# Altium schematic sheet DRIVER_B.SchDoc
size 420 x 297 mm; SheetNumber: 3; PageSetup: Record=PageOptions|CenterHorizontal=False|CenterVertical=False|PrintScale=0.95|XCorrection=0.00|YCorrection=0.00|PrintKind=1|BorderSize=5000000|LeftOffset=0|BottomOffset=0|Orientation=1|PaperLength=1000|PaperWidth=1000|Scale=100|PaperSource=15|PrintQuality=600|MediaType=1|DitherType=10|PaperKind=A4|PrintScaleMode=1
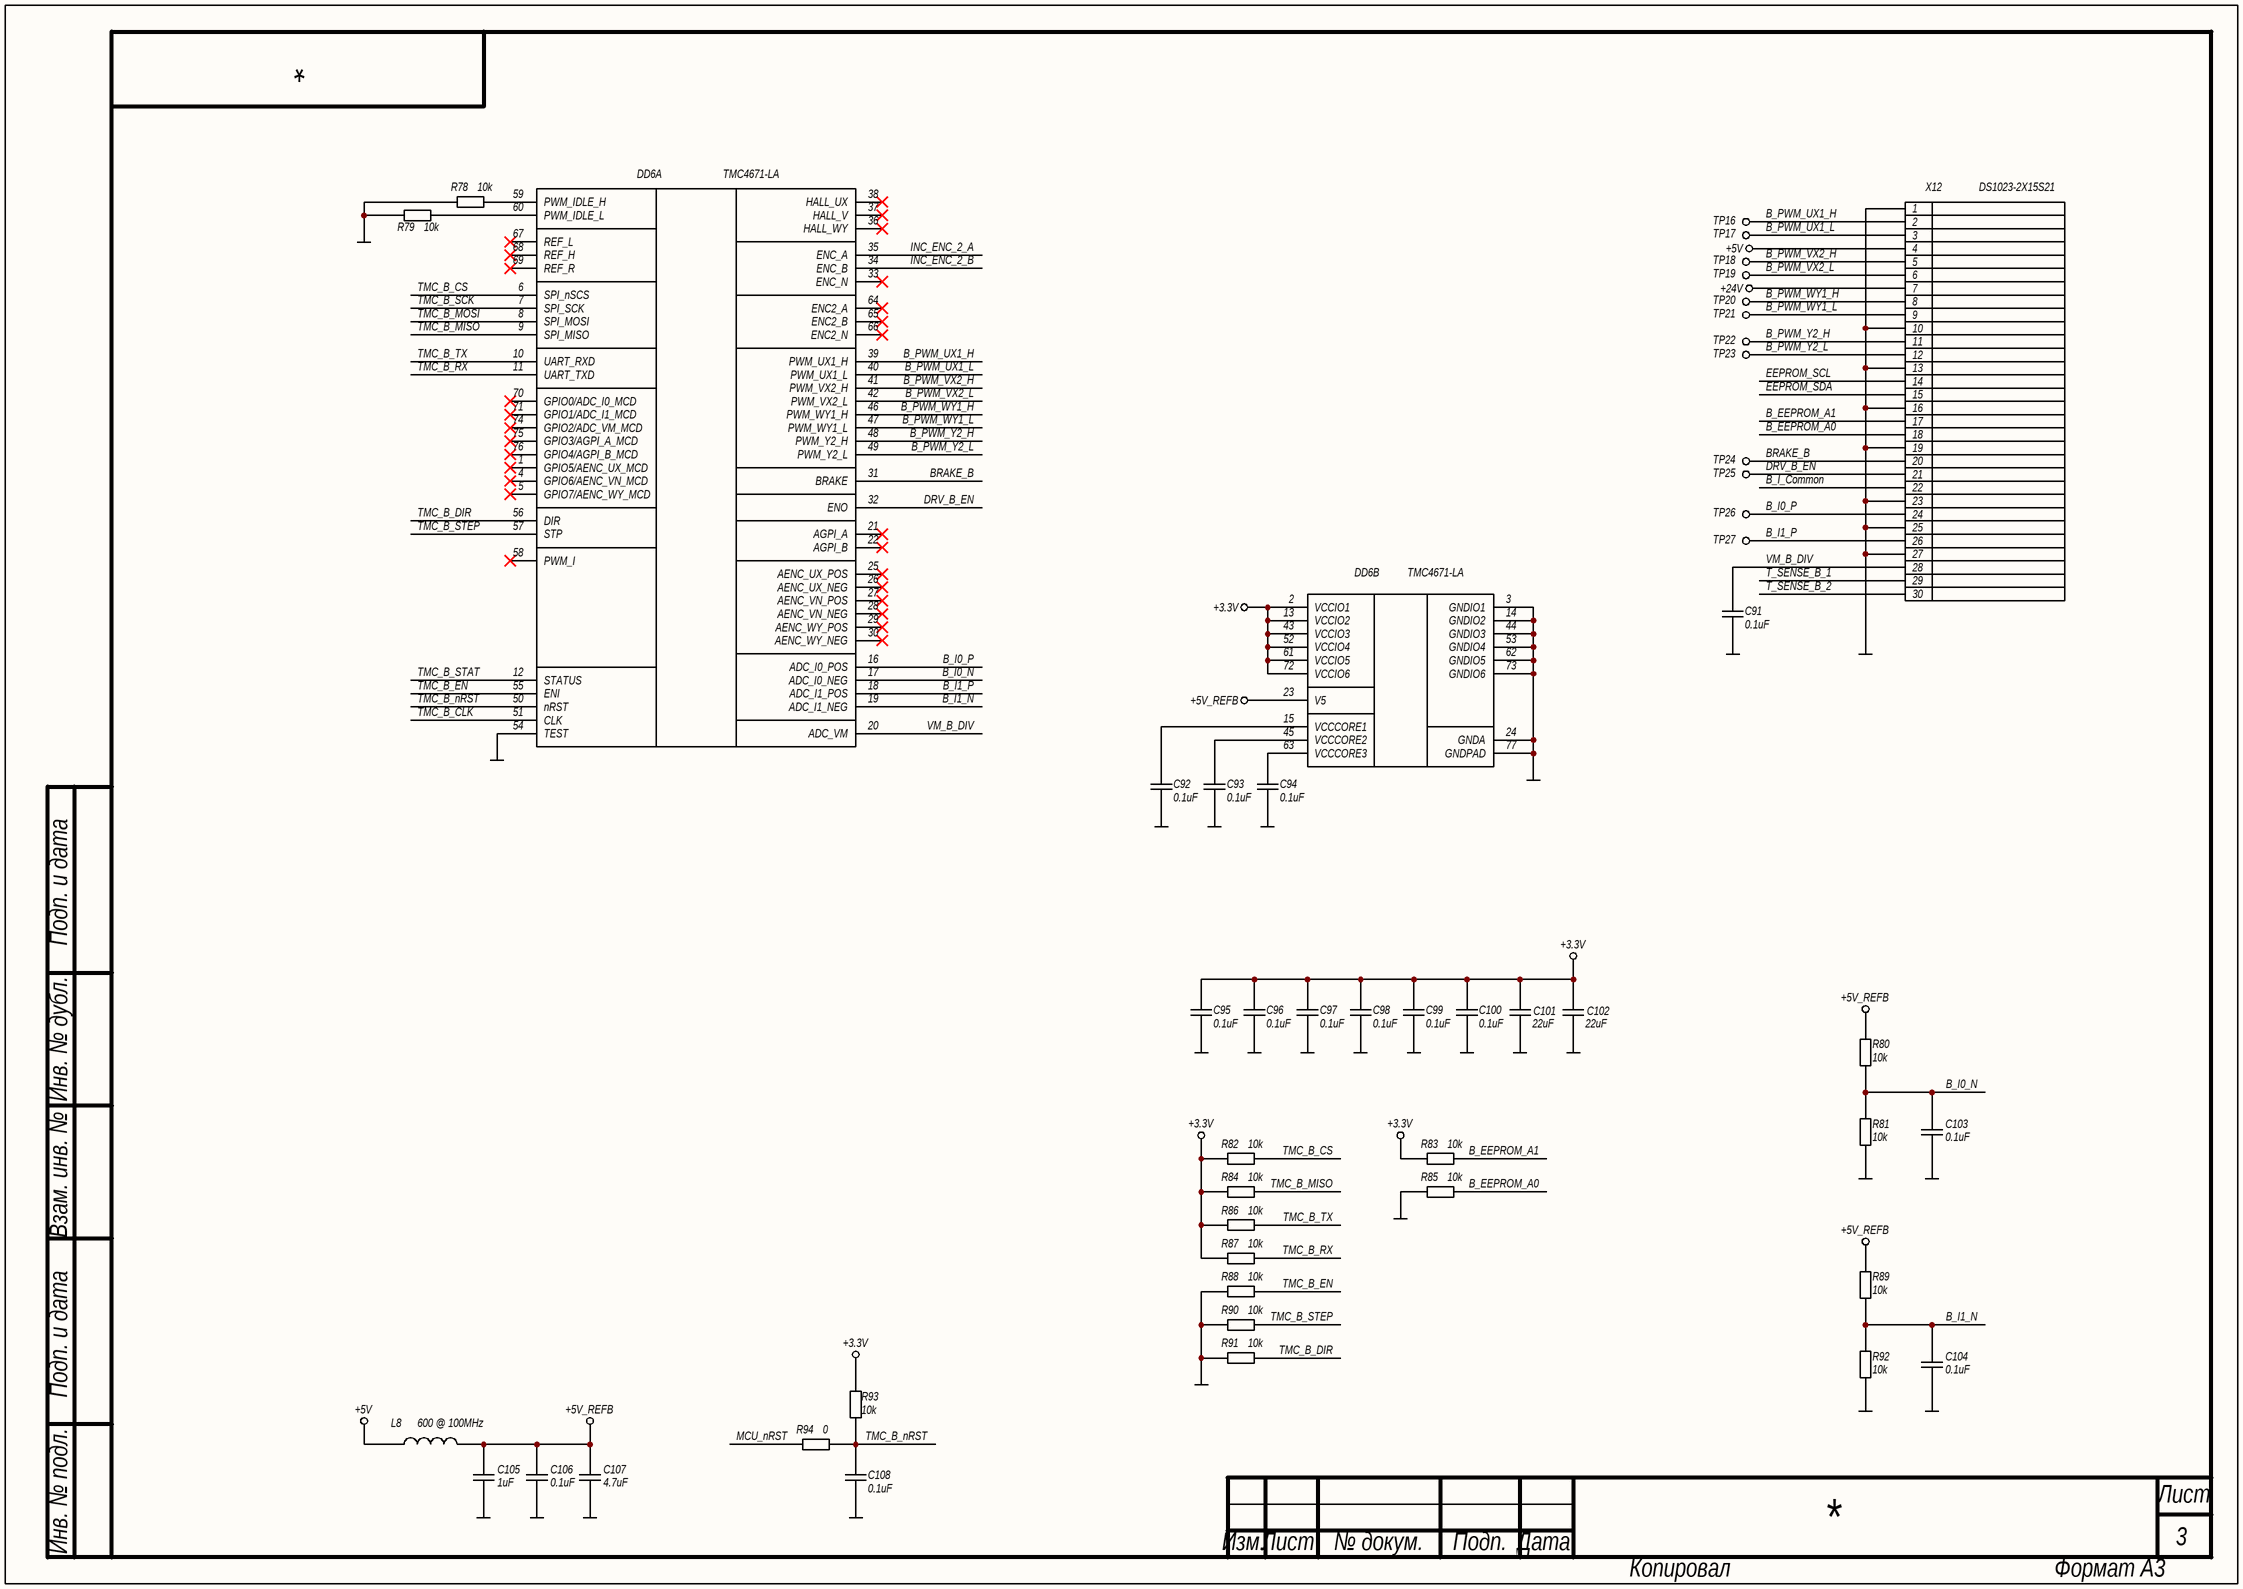
[diagram p0: DRIVER_B.SchDoc]

## Parts
C91  0.1uF  [C0603N]
C92  0.1uF  [C0603N]
C93  0.1uF  [C0603N]
C94  0.1uF  [C0603N]
C95  0.1uF  [C0603N]
C96  0.1uF  [C0603N]
C97  0.1uF  [C0603N]
C98  0.1uF  [C0603N]
C99  0.1uF  [C0603N]
C100  0.1uF  [C0603N]
C101  22uF  [C0805N]
C102  22uF  [C0805N]
C103  0.1uF  [C0603N]
C104  0.1uF  [C0603N]
C105  1uF  [C0603N]
C106  0.1uF  [C0603N]
C107  4.7uF  [C0603N]
C108  0.1uF  [C0603N]
DD6  TMC4671-LA  [QFN76-EP]  (parts A,B of 2)
L8  600 @ 100MHz  [FB0603N]
R78  10k  [R0603N]
R79  10k  [R0603N]
R80  10k  [R0603N]
R81  10k  [R0603N]
R82  10k  [R0603N]
R83  10k  [R0603N]
R84  10k  [R0603N]
R85  10k  [R0603N]
R86  10k  [R0603N]
R87  10k  [R0603N]
R88  10k  [R0603N]
R89  10k  [R0603N]
R90  10k  [R0603N]
R91  10k  [R0603N]
R92  10k  [R0603N]
R93  10k  [R0603N]
R94  0  [R0603N]
TP16  TEST_POINT  [TP_RPAD_0.8MM]  (value not drawn)  (no BOM)
TP17  TEST_POINT  [TP_RPAD_0.8MM]  (value not drawn)  (no BOM)
TP18  TEST_POINT  [TP_RPAD_0.8MM]  (value not drawn)  (no BOM)
TP19  TEST_POINT  [TP_RPAD_0.8MM]  (value not drawn)  (no BOM)
TP20  TEST_POINT  [TP_RPAD_0.8MM]  (value not drawn)  (no BOM)
TP21  TEST_POINT  [TP_RPAD_0.8MM]  (value not drawn)  (no BOM)
TP22  TEST_POINT  [TP_RPAD_0.8MM]  (value not drawn)  (no BOM)
TP23  TEST_POINT  [TP_RPAD_0.8MM]  (value not drawn)  (no BOM)
TP24  TEST_POINT  [TP_RPAD_0.8MM]  (value not drawn)  (no BOM)
TP25  TEST_POINT  [TP_RPAD_0.8MM]  (value not drawn)  (no BOM)
TP26  TEST_POINT  [TP_RPAD_0.8MM]  (value not drawn)  (no BOM)
TP27  TEST_POINT  [TP_RPAD_0.8MM]  (value not drawn)  (no BOM)
X12  DS1023-2X15S21  [2.54_2X15_SOCKET_HEADER]

## Nets
+3.3V: C95.2 C96.2 C97.2 C98.2 C99.2 C100.2 C101.2 C102.2 DD6.2(VCCIO1) DD6.13(VCCIO2) DD6.43(VCCIO3) DD6.52(VCCIO4) DD6.61(VCCIO5) DD6.72(VCCIO6) R82.2 R83.2 R84.2 R86.2 R87.2 R93.2
+5V: L8.1 X12.4
+5V_REFB: C105.2 C106.2 C107.2 DD6.23(V5) L8.2 R80.2 R89.2
+24V: X12.7
GND: C91.1 C92.1 C93.1 C94.1 C95.1 C96.1 C97.1 C98.1 C99.1 C100.1 C101.1 C102.1 C103.1 C104.1 C105.1 C106.1 C107.1 C108.1 DD6.3(GNDIO1) DD6.14(GNDIO2) DD6.24(GNDA) DD6.44(GNDIO3) DD6.53(GNDIO4) DD6.54(TEST) DD6.62(GNDIO5) DD6.73(GNDIO6) DD6.77(GNDPAD) R78.2 R79.2 R81.1 R85.2 R88.2 R90.2 R91.2 R92.1 X12.1 X12.10 X12.13 X12.16 X12.19 X12.23 X12.25 X12.27
B_EEPROM_A0: R85.1 X12.18
B_EEPROM_A1: R83.1 X12.17
B_I0_N: C103.2 DD6.17(ADC_I0_NEG) R80.1 R81.2
B_I0_P: DD6.16(ADC_I0_POS) TP26.1 X12.24
B_I1_N: C104.2 DD6.19(ADC_I1_NEG) R89.1 R92.2
B_I1_P: DD6.18(ADC_I1_POS) TP27.1 X12.26
B_I_Common: X12.22
B_PWM_UX1_H: DD6.39(PWM_UX1_H) TP16.1 X12.2
B_PWM_UX1_L: DD6.40(PWM_UX1_L) TP17.1 X12.3
B_PWM_VX2_H: DD6.41(PWM_VX2_H) TP18.1 X12.5
B_PWM_VX2_L: DD6.42(PWM_VX2_L) TP19.1 X12.6
B_PWM_WY1_H: DD6.46(PWM_WY1_H) TP20.1 X12.8
B_PWM_WY1_L: DD6.47(PWM_WY1_L) TP21.1 X12.9
B_PWM_Y2_H: DD6.48(PWM_Y2_H) TP22.1 X12.11
B_PWM_Y2_L: DD6.49(PWM_Y2_L) TP23.1 X12.12
BRAKE_B: DD6.31(BRAKE) TP24.1 X12.20
DRV_B_EN: DD6.32(ENO) TP25.1 X12.21
EEPROM_SCL: X12.14
EEPROM_SDA: X12.15
INC_ENC_2_A: DD6.35(ENC_A)
INC_ENC_2_B: DD6.34(ENC_B)
MCU_nRST: R94.2
T_SENSE_B_1: X12.29
T_SENSE_B_2: X12.30
TMC_B_CLK: DD6.51(CLK)
TMC_B_CS: DD6.6(SPI_nSCS) R82.1
TMC_B_DIR: DD6.56(DIR) R91.1
TMC_B_EN: DD6.55(ENI) R88.1
TMC_B_MISO: DD6.9(SPI_MISO) R84.1
TMC_B_MOSI: DD6.8(SPI_MOSI)
TMC_B_nRST: C108.2 DD6.50(nRST) R93.1 R94.1
TMC_B_RX: DD6.11(UART_TXD) R87.1
TMC_B_SCK: DD6.7(SPI_SCK)
TMC_B_STAT: DD6.12(STATUS)
TMC_B_STEP: DD6.57(STP) R90.1
TMC_B_TX: DD6.10(UART_RXD) R86.1
VM_B_DIV: C91.2 DD6.20(ADC_VM) X12.28
NetC92_2: C92.2 DD6.15(VCCCORE1)
NetC93_2: C93.2 DD6.45(VCCCORE2)
NetC94_2: C94.2 DD6.63(VCCCORE3)
NetDD6_59: DD6.59(PWM_IDLE_H) R78.1
NetDD6_60: DD6.60(PWM_IDLE_L) R79.1

Not connected (* = marked no-connect by the designer): DD6 1(GPIO5/AENC_UX_MCD)* 4(GPIO6/AENC_VN_MCD)* 5(GPIO7/AENC_WY_MCD)* 21(AGPI_A)* 22(AGPI_B)* 25(AENC_UX_POS)* 26(AENC_UX_NEG)* 27(AENC_VN_POS)* 28(AENC_VN_NEG)* 29(AENC_WY_POS)* 30(AENC_WY_NEG)* 33(ENC_N)* 36(HALL_WY)* 37(HALL_V)* 38(HALL_UX)* 58(PWM_I)* 64(ENC2_A)* 65(ENC2_B)* 66(ENC2_N)* 67(REF_L)* 68(REF_H)* 69(REF_R)* 70(GPIO0/ADC_I0_MCD)* 71(GPIO1/ADC_I1_MCD)* 74(GPIO2/ADC_VM_MCD)* 75(GPIO3/AGPI_A_MCD)* 76(GPIO4/AGPI_B_MCD)*

## Notes on the sheet
- Подп. и дата
- Инв. № дубл.
- Взам. инв. №
- Инв. № подл.
- Лист
- Изм.
- № докум.
- Подп.
- Дата
- Копировал
- Формат А3

## Library data of the parts
C91-C100 C103 C104 C106 C108 = CL10B104KB8NNNC: Конденсатор; Точность: 10%; Напряжение: 50V; Диэлектрик: X7R; Производитель: Samsung Electro-Mechanics; Описание: 0.1 µF ±10% 50V Ceramic Capacitor X7R 0603 (1608 Metric); Корпус: 0603 (1608 Metric); Температурный диапазон: -55°C ~ 125°C; Вид монтажа: SMD; Артикул: CL10B104KB8NNNC; Номинал: 0.1uF; Строка для документации: https://mm.digikey.com/Volume0/opasdata/d220001/medias/docus/609/CL10B104KB8NNNC_Spec.pdf; Тип элемента: Конденсатор
C101 C102 = CL21A226MOCLRNC: Конденсатор; Точность: 20%; Напряжение: 16V; Диэлектрик: X5R; Производитель: Samsung Electro-Mechanics; Описание: 22 µF ±20% 16V Ceramic Capacitor X5R 0805 (2012 Metric); Корпус: 0805 (2012 Metric); Температурный диапазон: -55°C ~ 85°C; Вид монтажа: SMD; Артикул: CL21A226MOCLRNC; Номинал: 22uF; Строка для документации: https://mm.digikey.com/Volume0/opasdata/d220001/medias/docus/43/CL21A226MOCLRNC_Spec.pdf; Тип элемента: Конденсатор
C105 = CL10B105KO8NNNC: Конденсатор; Точность: 10%; Напряжение: 16V; Диэлектрик: X7R; Производитель: YAGEO; Описание: 1 µF ±10% 16V Ceramic Capacitor X7R 0603 (1608 Metric); Корпус: 0603 (1608 Metric); Температурный диапазон: -55°C ~ 125°C; Вид монтажа: SMD; Артикул: CL10B105KO8NNNC; Номинал: 1uF; Строка для документации: https://weblib.samsungsem.com/mlcc/mlcc-ec-data-sheet.do?partNumber=CL10B105KO8NNN; Тип элемента: Конденсатор
C107 = CL10A475KO8NNNC: Конденсатор; Точность: 10%; Напряжение: 16V; Диэлектрик: X5R; Производитель: Samsung Electro-Mechanics; Описание: 4.7 µF ±10% 16V Ceramic Capacitor X5R 0603 (1608 Metric); Корпус: 0603 (1608 Metric); Температурный диапазон: -55°C ~ 85°C; Вид монтажа: SMD; Артикул: CL10A475KO8NNNC; Номинал: 4.7uF; Строка для документации: https://mm.digikey.com/Volume0/opasdata/d220001/medias/docus/2328/CL10A475KO8NNNC_Spec.pdf; Тип элемента: Конденсатор
DD6 = TMC4671-LA: Микросхема драйвер двигателя; Производитель: Analog Devices Inc.; Описание: Multiphase Motor Driver Power MOSFET SPI, Step/Direction 76-QFN (10.5x6.5); Корпус: 76-VFQFN Exposed Pad; Температурный диапазон: -40°C ~ 125°C (TJ); Вид монтажа: SMD; Артикул: TMC4671-LA; Строка для документации: https://www.analog.com/media/en/technical-documentation/data-sheets/TMC4671-LA_datasheet_Rev2.07.pdf; Тип элемента: Микросхема
L8 = BLM18AG601SN1D: Фильтр ЭМП индуктивный; Ток: 500mA; Сопротивление: 380m; Тип: Ferrite Bead; Производитель: Murata Electronics; Описание: 600 Ohms @ 100 MHz 1 Ferrite Bead 0603 (1608 Metric) 500mA 380mOhm; Корпус: 0603 (1608 Metric); Температурный диапазон: -55°C ~ 125°C; Вид монтажа: SMD; Артикул: BLM18AG601SN1D; Номинал: 600 @ 100MHz; Строка для документации: https://www.murata.com/en-us/products/productdata/8796738650142/ENFA0003.pdf; Тип элемента: Фильтр ЭМП
R78-R93 = RC0603FR-0710KL: Резистор; Точность: 1%; ТКС: ±100ppm/°C; Напряжение: 75V; Производитель: YAGEO; Описание: 10 kOhms ±1% 0.1W, 1/10W Chip Resistor 0603 (1608 Metric) Moisture Resistant Thick Film; Корпус: 0603 (1608 Metric); Температурный диапазон: -55°C ~ 155°C; Вид монтажа: SMD; Артикул: RC0603FR-0710KL; Номинал: 10k; Строка для документации: https://www.yageo.com/upload/media/product/app/datasheet/rchip/pyu-rc_group_51_rohs_l.pdf; Тип элемента: Резистор
R94 = RC0603FR-070RL: Резистор; Точность: 1%; ТКС: ±100ppm/°C; Напряжение: 75V; Производитель: YAGEO; Описание: 0 Ohms Jumper Chip Resistor 0603 (1608 Metric) Moisture Resistant Thick Film; Корпус: 0603 (1608 Metric); Температурный диапазон: -55°C ~ 155°C; Вид монтажа: SMD; Артикул: RC0603FR-070RL; Номинал: 0; Строка для документации: https://www.yageo.com/upload/media/product/app/datasheet/rchip/pyu-rc_group_51_rohs_l.pdf; Тип элемента: Резистор
TP16-TP27 = Test Point, Round Pad, 0.8mm diameter: Контрольная точка; Количество контактов: 1; Тип элемента: Разъем; Артикул: Test Point, Round Pad, 0.8mm diameter; Тип разъема: Test Point; Описание: Test Point, Round Pad, 0.8mm diameter
X12 = DS1023-2X15S21: Разъем, 30 контактов; Тип разъема: Header, Female Socket; Количество контактов: 30; Шаг контактов: 2.54mm; Ток: 3A; Напряжение: 250V; Производитель: Connfly electronic (Zhenqin); Описание: Connector Header Through Hole 30 position 0.100" (2.54mm); Температурный диапазон: -40°C ~ 105°C; Вид монтажа: Through Hole; Артикул: DS1023-2X15S21; Строка для документации: http://cn.connfly.group/static/upload/file/pdf/DS1023.pdf; Тип элемента: Разъем